# EAGLE design MySXMotion (EAGLE 6.6.0)
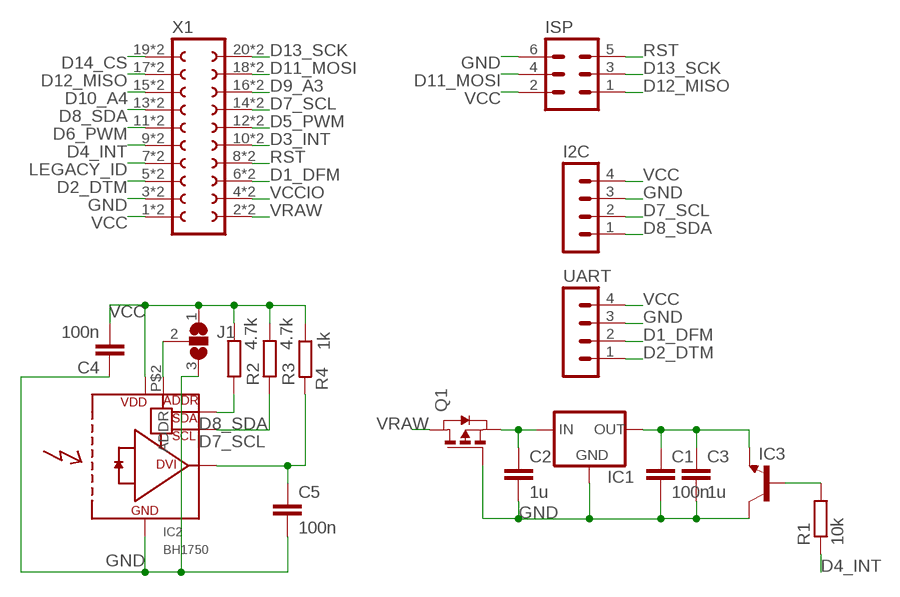
[diagram p0: schematic, sheet 1]

## Parts
C1  100n  C-EUC0603  [C0603]
C2  1u  C-EUC0603  [C0603]
C3  1u  C-EUC0805  [C0805]
C4  100n  C-EUC0603  [C0603]
C5  100n  C-EUC0603  [C0603]
I2C  MA04-1  [MA04-1]
IC1  XC63FPM  [SOT23]
IC2  BH1750  [WSOF6]
IC3  -NPN-TO5  [TO5]
ISP  MA03-2  [MA03-2]
J1  SJ2W  [SJ_2]
Q1  PMOSSOT23  [SOT-23]
R1  10k  R-EU_R0603  [R0603]
R2  4.7k  R-EU_R0603  [R0603]
R3  4.7k  R-EU_R0603  [R0603]
R4  1k  R-EU_R0603  [R0603]
UART  MA04-1  [MA04-1]
X1  FE10-2  [FE10-2]

## Nets
D1_DFM: UART.2 X1.6 X1.P$6
D2_DTM: UART.1 X1.5 X1.P$5
D3_INT: X1.10 X1.P$10
D4_INT: R1.1 X1.9 X1.P$9
D5_PWM: X1.12 X1.P$12
D6_PWM: X1.11 X1.P$11
D7_SCL: I2C.2 IC2.P$6(SCL) R3.1 X1.14 X1.P$14
D8_SDA: I2C.1 IC2.P$4(SDA) R2.1 X1.13 X1.P$13
D9_A3: X1.16 X1.P$16
D10_A4: X1.15 X1.P$15
D11_MOSI: ISP.4 X1.18 X1.P$18
D12_MISO: ISP.1 X1.17 X1.P$17
D13_SCK: ISP.3 X1.20 X1.P$20
D14_CS: X1.19 X1.P$19
GND [power]: C1.2 C2.2 C3.2 C4.1 C5.2 I2C.3 IC1.1(GND) IC2.P$3(GND) IC3.3(C) ISP.6 J1.3 Q1.3(G) UART.3 X1.3 X1.P$3
LEGACY_ID: X1.7 X1.P$7
N$1: C5.1 IC2.P$5(DVI) R4.2
N$2: IC2.P$2(ADDR) J1.2
N$3: IC3.2(B) R1.2
N$4 [power]: C2.1 IC1.3(IN) Q1.2(S)
N$7 [power]: C1.1 C3.1 IC1.2(OUT) IC3.1(E)
RST: ISP.5 X1.8 X1.P$8
VCC [power]: C4.2 I2C.4 IC2.P$1(VCC) ISP.2 J1.1 R2.2 R3.2 R4.1 UART.4 X1.1 X1.P$1
VCCIO [power]: X1.4 X1.P$4
VRAW [power]: Q1.1(D) X1.2 X1.P$2

## Library data of the parts
C1-C5 = rcl:C-EU: CAPACITOR, European symbol
I2C UART = con-lstb:MA04-1: PIN HEADER; OC_FARNELL: unknown; OC_NEWARK: unknown
IC1 = v-reg:XC63FP: Positiv Voltage Regulators www.torex.co.jp/english/product/pro02/pdf/0201_xc62fp.pdf
IC2 = bh1750:BH1750
IC3 = transistor:*-NPN-: NPN Transistror BF959 corrected 2008.03.06
ISP = con-lstb:MA03-2: PIN HEADER; OC_FARNELL: unknown; OC_NEWARK: unknown
J1 = jumper:SJ2W: SMD solder JUMPER
Q1 = zetex:PMOSSOT23: MOS FET; OC_FARNELL: unknown; OC_NEWARK: unknown
R1-R4 = rcl:R-EU_: RESISTOR, European symbol
X1 = my-con-lsta:FE10-2: FEMALE HEADER; OC_FARNELL: unknown; OC_NEWARK: unknown

## Net classes
0 default: width 0.203 mm
1 power: width 0.508 mm

## Board
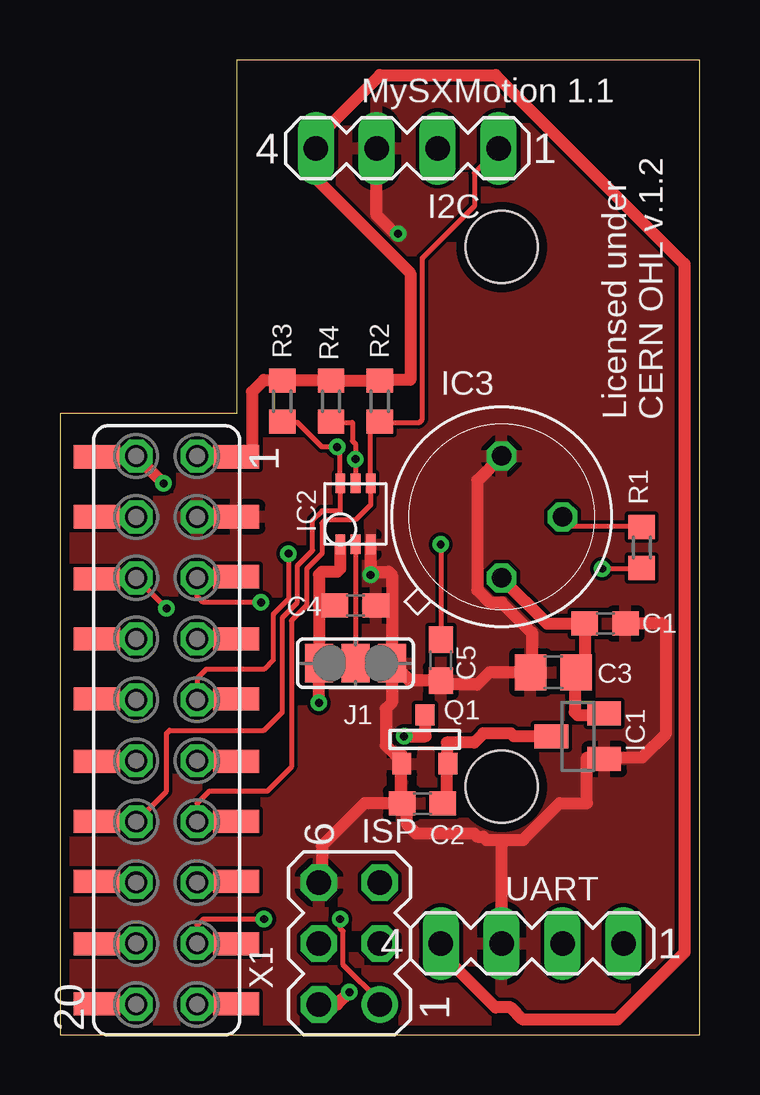
[diagram p1: board, top side]
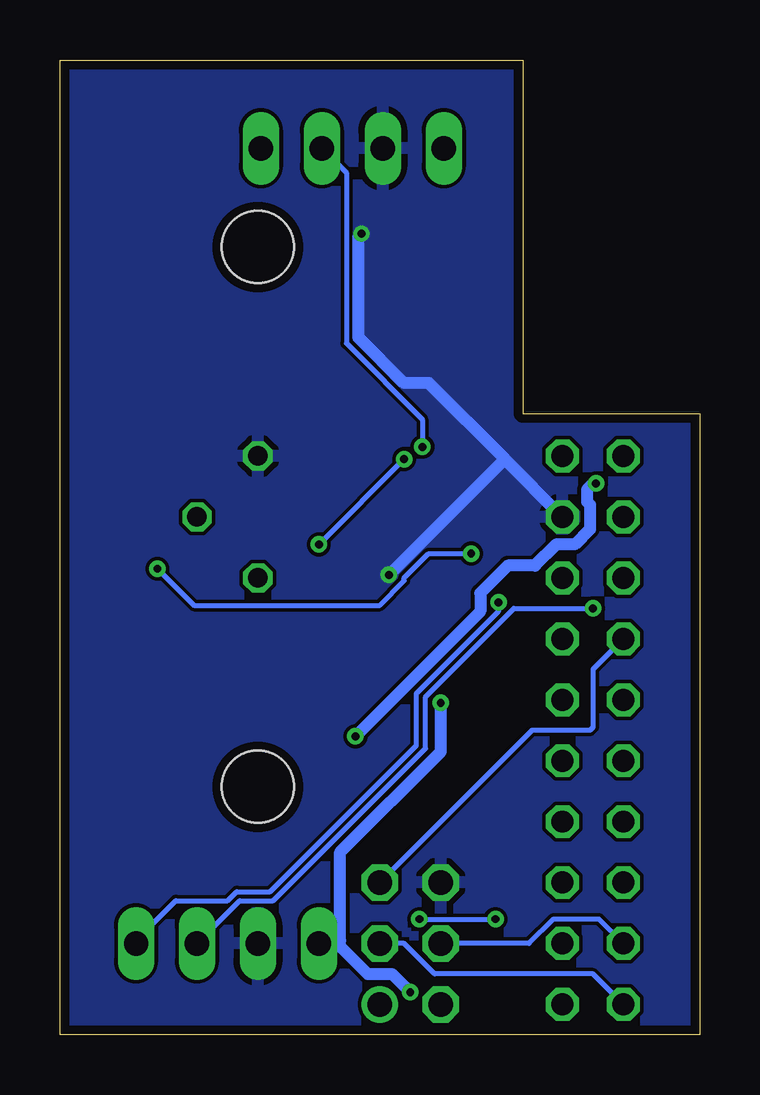
[diagram p2: board, bottom side, seen from below]

Size 26.67 x 40.64 mm. Coordinates in mm from the lower left corner, seen from the top.
Outline: 0,0 26.67,0 26.67,40.64 7.37,40.64 7.37,25.91 0,25.91 0,0
Copper layers (1*16): Top 0.0356mm / dielectric 1.5011mm / Bottom 0.0356mm
Design rules "PCBs_io": minimum track width 6mil, minimum drill 13mil, track to track 6mil, track to pad 6mil, pad to pad 6mil, via to via 6mil, smd to smd 6mil, copper to edge 15mil, drill to drill 6mil, minimum pad ring 7mil, minimum via ring 7mil, stop-mask expansion 3mil, vias tented up to drill 0mil, thermal gap 10mil
Holes 3 mm at 18.41,10.34 18.41,32.84

### Footprints (pad centres in the part's own frame; a part is rotated, then mirrored left to right if it is on the bottom)
C0603 = smd 1.1 x 1: 1 -0.85,0; 2 0.85,0
C0805 = smd 1.3 x 1.5: 1 -0.95,0; 2 0.95,0
MA04-1 = drill 1.016 long: 1 -3.81,0; 2 -1.27,0; 3 1.27,0; 4 3.81,0
SOT23 = smd 1 x 1.4: 1 -0.95,-1.1; 2 0.95,-1.1; 3 0,1.1
WSOF6 = smd 0.406 x 0.813: P$1 -0.635,-1.27; P$2 0,-1.27; P$3 0.635,-1.27; P$4 0.635,1.27; P$5 0,1.27; P$6 -0.635,1.27
TO5 = drill 0.813 octagon: 1 0,-2.54; 2 2.54,0; 3 0,2.54
MA03-2 = drill 1.016: 1 -2.54,-1.27 | drill 1.016 octagon: 2 -2.54,1.27; 3 0,-1.27; 4 0,1.27; 5 2.54,-1.27; 6 2.54,1.27
SJ_2 = smd 1.168 x 1.6: 1 -1.524,0; 2 0,0; 3 1.524,0
SOT-23 = smd 0.787 x 0.889: 1 0.025,-1.016; 2 -0.94,1.016; 3 0.991,1.016
R0603 = smd 1 x 1.1: 1 -0.85,0; 2 0.85,0
FE10-2 = drill 0.914 octagon: 1 -11.43,1.27; 2 -11.43,-1.27; 3 -8.89,1.27; 4 -8.89,-1.27; 5 -6.35,1.27; 6 -6.35,-1.27; 7 -3.81,1.27; 8 -3.81,-1.27; 9 -1.27,1.27; 10 -1.27,-1.27; 11 1.27,1.27; 12 1.27,-1.27; 13 3.81,1.27; 14 3.81,-1.27; 15 6.35,1.27; 16 6.35,-1.27; 17 8.89,1.27; 18 8.89,-1.27; 19 11.43,1.27; 20 11.43,-1.27 | smd 0.965 x 1.93: P$1 -11.4,2.9; P$2 -11.4,-2.9; P$3 -8.9,2.9; P$4 -8.9,-2.9; P$5 -6.4,2.9; P$6 -6.3,-2.9; P$7 -3.8,2.9; P$8 -3.8,-2.9; P$9 -1.3,2.9; P$10 -1.3,-2.9; P$11 1.3,2.9; P$12 1.3,-2.9; P$13 3.8,2.9; P$14 3.8,-2.9; P$15 6.3,2.9; P$16 6.3,-2.9; P$17 8.9,2.9; P$18 8.9,-2.9; P$19 11.4,2.9; P$20 11.4,-2.9

### Placement (x,y rotation side)
C1  22.73,17.14 0 top
C2  15.11,9.65 180 top
C3  20.57,15.11 180 top
C4  12.32,17.91 180 top
C5  15.88,15.62 270 top
I2C  14.48,36.96 180 top
IC1  21.59,12.45 90 top
IC2  12.32,21.72 0 top
IC3  18.41,21.59 0 top
ISP  12.06,3.81 90 top
J1  12.32,15.49 0 top
Q1  15.24,12.32 180 top
R1  24.26,20.32 90 top
R2  13.33,26.42 90 top
R3  9.27,26.42 90 top
R4  11.3,26.42 270 top
UART  19.68,3.81 180 top
X1  4.45,12.7 270 top

### Tracks (layer width: path | path; a pad name or v marks a point on that pad's centre or on a via)
D1_DFM  (via drill 0.33)
  Top 0.203: v4.45,17.78 X1.6 1.65,19.05 X1.P$6
  Bottom 0.203: v4.45,17.78 7.75,17.78 11.43,14.1 11.43,11.94 17.78,5.59 19.18,5.59 UART.2
D2_DTM  (via drill 0.33)
  Top 0.203: v8.38,18.03 5.97,18.03 5.71,18.29 X1.5 7.24,19.05 X1.P$5
  Bottom 0.203: v8.38,18.03 8.38,17.65 11.81,14.22 11.81,12.06 17.91,5.97 19.3,5.97 19.68,5.59 21.84,5.59 23.5,3.94 UART.1
D3_INT
  Top 0.203: X1.10 1.65,13.97 X1.P$10
D4_INT  (via drill 0.33)
  Top 0.203: v9.53,20.07 9.53,18.16 8.89,17.53 8.89,15.62 8.51,15.24 6.1,15.24 5.71,14.86 X1.9 7.24,13.97 X1.P$9 | v22.61,19.43 24.26,19.43 R1.1
  Bottom 0.203: v9.53,20.07 11.3,20.07 12.32,19.05 12.32,18.92 13.33,17.91 21.08,17.91 v22.61,19.43
D5_PWM
  Top 0.203: X1.12 1.65,11.43 X1.P$12
D6_PWM
  Top 0.203: X1.11 7.24,11.43 X1.P$11
D7_SCL  (via drill 0.33)
  Top 0.203: X1.P$14 1.65,8.89 X1.14 4.45,10.16 4.45,12.57 4.57,12.7 8.51,12.7 9.27,13.46 9.27,17.4 9.91,18.03 9.91,19.56 10.54,20.19 10.54,21.46 10.92,21.84 11.68,21.84 IC2.P$6 11.68,24.38 v11.56,24.51 10.92,24.51 9.91,25.53 9.27,25.53 R3.1
  Bottom 0.203: v11.56,24.51 11.56,25.65 14.73,28.83 14.73,35.94 I2C.2
D8_SDA
  Top 0.203: I2C.1 17.27,35.94 17.27,34.54 15.11,32.38 15.11,25.65 14.99,25.53 13.33,25.53 R2.1 12.95,25.18 IC2.P$4 12.95,22.1 12.32,21.46 11.05,21.46 10.92,21.34 10.92,20.07 10.29,19.43 10.29,17.91 9.65,17.27 9.65,11.18 8.64,10.16 6.22,10.16 5.71,9.65 X1.13 7.24,8.89 X1.P$13
D9_A3
  Top 0.203: X1.16 1.65,6.35 X1.P$16
D10_A4
  Top 0.203: X1.15 7.24,6.35 X1.P$15
D11_MOSI
  Top 0.203: X1.18 1.65,3.81 X1.P$18
  Bottom 0.203: ISP.4 7.11,3.81 6.1,4.83 4.19,4.83 X1.18
D12_MISO  (via drill 0.33)
  Top 0.203: v8.51,4.83 5.97,4.83 5.71,4.57 X1.17 7.24,3.81 X1.P$17 | v11.68,4.83 11.68,4.45 11.81,4.32 11.81,2.92 13.33,1.4 ISP.1
  Bottom 0.203: v11.68,4.83 v8.51,4.83
D13_SCK
  Top 0.203: X1.20 1.65,1.27 X1.P$20
  Bottom 0.203: ISP.3 12.32,3.81 11.05,2.54 4.45,2.54 X1.20
D14_CS
  Top 0.203: X1.19 7.24,1.27 X1.P$19
GND  (via drill 0.33)
  Top 0.508: 13.84,17.91 13.84,19.18 13.72,19.3 13.08,19.3 | 13.84,17.91 J1.3 | 13.08,19.3 12.95,19.43 IC2.P$3 | C4.1 13.84,17.91 | J1.3 14.57,14.77 C5.2 16.04,14.61 17.4,14.61 17.91,15.11 C3.2 19.68,15.24 19.68,16.76 18.41,18.03 17.91,18.03 17.4,18.54 17.4,23.11 IC3.3 | 13.97,33.4 v14.1,33.4 13.84,33.53 13.21,34.16 I2C.3 | v12.95,19.18 13.08,19.3 | C1.2 25.15,17.14 25.27,17.02 25.27,12.57 24.26,11.56 22.73,11.56 IC1.1 22.48,11.56 21.97,11.56 21.97,9.65 20.83,9.65 19.3,8.13 18.41,8.13 | 18.41,8.13 17.78,8.13 17.65,8.26 17.4,8.26 17.27,8.38 14.86,8.38 14.48,8.76 14.48,9.53 C2.2 | 18.41,8.13 UART.3 | 10.79,6.73 ISP.6 10.92,6.86 10.92,7.87 12.7,9.65 C2.2 | C2.2 14.22,9.65 14.22,11.3 Q1.3 14.22,11.43 14.22,11.68 13.97,11.68 13.59,12.06 13.59,13.59 13.84,13.84 J1.3 | X1.3 7.24,21.59 X1.P$3
  Bottom 0.508: v14.1,33.4 14.22,33.27 14.22,29.08 12.32,27.18 11.3,27.18 8.13,24 | X1.3 8.13,24 | v12.95,19.18 8.13,24
  pour Bottom: 0,0 26.67,0 26.67,40.64 7.37,40.64 7.37,25.91 0,25.91
  pour Top: 0,0 26.67,0 26.67,40.64 7.37,40.64 7.37,25.91 0,25.91
LEGACY_ID
  Top 0.203: X1.7 7.24,16.51 X1.P$7
N$1  (via drill 0.33)
  Top 0.203: IC2.P$5 v12.32,24 12.32,24.64 12.19,24.77 12.19,25.53 11.3,25.53 R4.2 | v15.88,20.45 C5.1
  Bottom 0.203: v12.32,24 v15.88,20.45
N$2
  Top 0.203: IC2.P$2 J1.2
N$3
  Top 0.203: IC3.2 21.34,21.21 24.26,21.21 R1.2
N$4
  Top 0.508: C2.1 16.13,9.65 16.13,11.3 Q1.2 16.13,11.43 16.13,12.19 17.27,12.19 17.65,12.57 18.8,12.57 18.92,12.45 IC1.3
N$7
  Top 0.508: IC3.1 20.32,17.14 C1.1 21.88,15.47 C3.1 21.46,14.99 21.46,13.46 21.59,13.34 22.61,13.34 IC1.2
RST
  Top 0.203: X1.8 1.65,16.51 X1.P$8
  Bottom 0.203: ISP.5 6.98,12.7 4.57,12.7 4.45,12.83 4.45,15.24 X1.8
VCC  (via drill 0.33)
  Top 0.508: 10.79,17.91 10.79,19.18 10.92,19.3 11.56,19.3 11.68,19.43 IC2.P$1 | 10.79,17.91 J1.1 v10.79,13.84 | X1.1 7.37,24.13 | 7.37,24.13 8,24.13 8,26.8 8.51,27.3 9.27,27.3 R3.2 9.4,27.3 11.3,27.3 R4.1 R2.2 13.46,27.3 14.61,27.3 14.61,31.75 10.67,35.69 I2C.4 10.67,37.34 13.33,40.01 18.16,40.01 26.04,32.13 26.04,3.43 23.24,0.64 19.3,0.64 18.8,1.14 18.16,1.14 15.88,3.43 UART.4 | C4.2 10.79,17.91 | ISP.2 11.56,1.27 v12.06,1.78 | 7.37,24.13 X1.P$1
  Bottom 0.508: v12.06,1.78 12.83,2.54 13.84,2.54 15.11,3.81 | UART.4 15.11,3.81 | v10.79,13.84 10.79,11.81 14.99,7.62 14.99,3.94 15.11,3.81
VCCIO
  Top 0.508: X1.4 1.65,21.59 X1.P$4
VRAW  (via drill 0.33)
  Top 0.508: v4.32,22.99 X1.2 1.65,24.13 X1.P$2 | v14.35,12.45 15.24,12.45 15.24,13.34 Q1.1
  Bottom 0.508: v14.35,12.45 9.14,17.65 9.14,18.41 8,19.56 6.86,19.56 5.97,20.45 5.21,20.45 4.57,21.08 4.57,22.1 4.7,22.23 4.7,22.73 4.45,22.99 v4.32,22.99

### Text on the board
tPlace: Licensed under / CERN OHL v.1.2
tNames: MySXMotion 1.1